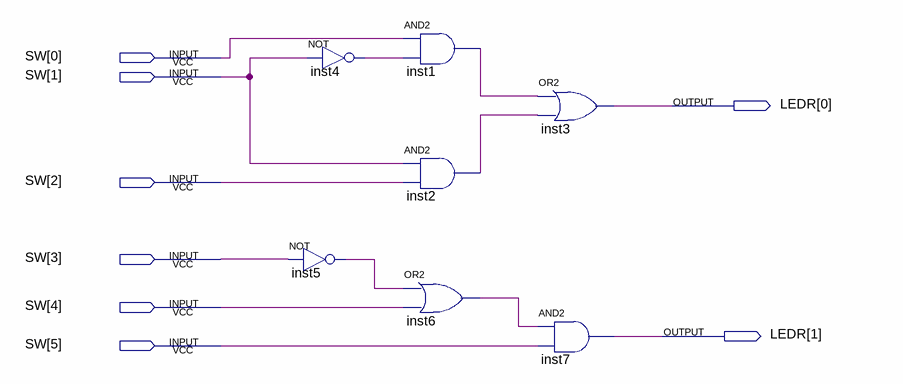
[diagram p0: schematic sheet]
// Quartus schematic Lab1.bdf as structural Verilog: 7 symbols, 8 pins
module Lab1 (
  input  [5:0] SW,
  output [1:0] LEDR
);

  wire inst1_out, inst2_out, inst4_out, inst5_out, inst6_out;

  not inst4 (inst4_out, SW[1]);
  not inst5 (inst5_out, SW[3]);
  and inst1 (inst1_out, SW[0], inst4_out);
  and inst2 (inst2_out, SW[1], SW[2]);
  or inst6 (inst6_out, inst5_out, SW[4]);
  or inst3 (LEDR[0], inst1_out, inst2_out);
  and inst7 (LEDR[1], inst6_out, SW[5]);
endmodule
